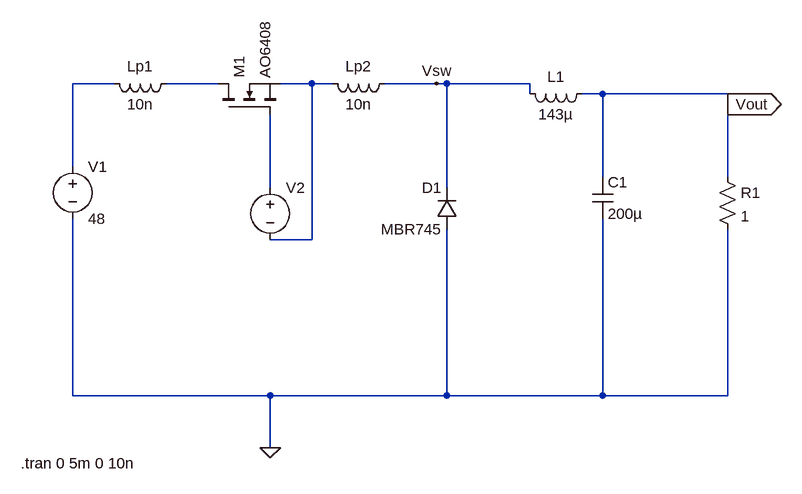
[diagram p0: schematic buck_filtered.asc]
buck_filtered.asc, the LTspice schematic file:
Version 4.1
SHEET 1 1084 680
WIRE 80 -304 16 -304
WIRE 240 -304 160 -304
WIRE 384 -304 336 -304
WIRE 416 -304 384 -304
WIRE 576 -304 496 -304
WIRE 592 -304 576 -304
WIRE 720 -304 592 -304
WIRE 720 -288 720 -304
WIRE 832 -288 800 -288
WIRE 1024 -288 832 -288
WIRE 1024 -272 1024 -288
WIRE 16 -176 16 -304
WIRE 832 -160 832 -288
WIRE 1024 -160 1024 -272
WIRE 320 -144 320 -256
WIRE 592 -144 592 -304
WIRE 384 -64 384 -304
WIRE 384 -64 320 -64
WIRE 16 176 16 -96
WIRE 320 176 16 176
WIRE 592 176 592 -80
WIRE 592 176 320 176
WIRE 832 176 832 -96
WIRE 832 176 592 176
WIRE 1024 176 1024 -80
WIRE 1024 176 832 176
WIRE 320 256 320 176
FLAG 1024 -272 Vout
IOPIN 1024 -272 Out
FLAG 320 256 0
FLAG 576 -304 Vsw
SYMBOL voltage 16 -192 R0
WINDOW 123 0 0 Left 0
WINDOW 39 0 0 Left 0
SYMATTR InstName V1
SYMATTR Value 48
SYMBOL cap 816 -160 R0
SYMATTR InstName C1
SYMATTR Value 200µ
SYMBOL res 1008 -176 R0
SYMATTR InstName R1
SYMATTR Value 1
SYMBOL voltage 320 -160 R0
WINDOW 3 24 44 Invisible 2
WINDOW 123 0 0 Left 0
WINDOW 39 0 0 Left 0
SYMATTR Value PULSE(0 12 0 1n 1n 10u 40u)
SYMATTR InstName V2
SYMBOL nmos 240 -256 R270
SYMATTR InstName M1
SYMATTR Value AO6408
SYMBOL ind 816 -304 R90
WINDOW 0 5 56 VBottom 2
WINDOW 3 32 56 VTop 2
SYMATTR InstName L1
SYMATTR Value 143µ
SYMATTR SpiceLine Rser=1m
SYMBOL ind 512 -320 R90
WINDOW 0 5 56 VBottom 2
WINDOW 3 32 56 VTop 2
SYMATTR InstName Lp2
SYMATTR Value 10n
SYMATTR SpiceLine Rser=1m
SYMBOL ind 176 -320 R90
WINDOW 0 5 56 VBottom 2
WINDOW 3 32 56 VTop 2
SYMATTR InstName Lp1
SYMATTR Value 10n
SYMATTR SpiceLine Rser=1m
SYMBOL diode 608 -80 R180
WINDOW 0 24 64 Left 2
WINDOW 3 24 0 Left 2
SYMATTR InstName D1
SYMATTR Value MBR745
TEXT -64 280 Left 2 !.tran 0 5m 0 10n

The netlist it stands for:
* buck_filtered.asc
V1 N001 0 48
C1 Vout 0 200µ
R1 Vout 0 1
V2 N004 N003 PULSE(0 12 0 1n 1n 10u 40u)
M1 N002 N004 N003 N003 AO6408
L1 Vout Vsw 143µ Rser=1m
Lp2 Vsw N003 10n Rser=1m
Lp1 N002 N001 10n Rser=1m
D1 0 Vsw MBR745
.model D D
.lib standard.dio
.model NMOS NMOS
.model PMOS PMOS
.lib standard.mos
.tran 0 5m 0 10n
.backanno
.end